# EAGLE design BusPirate-v3.9-SSOP (EAGLE 7.6.0)
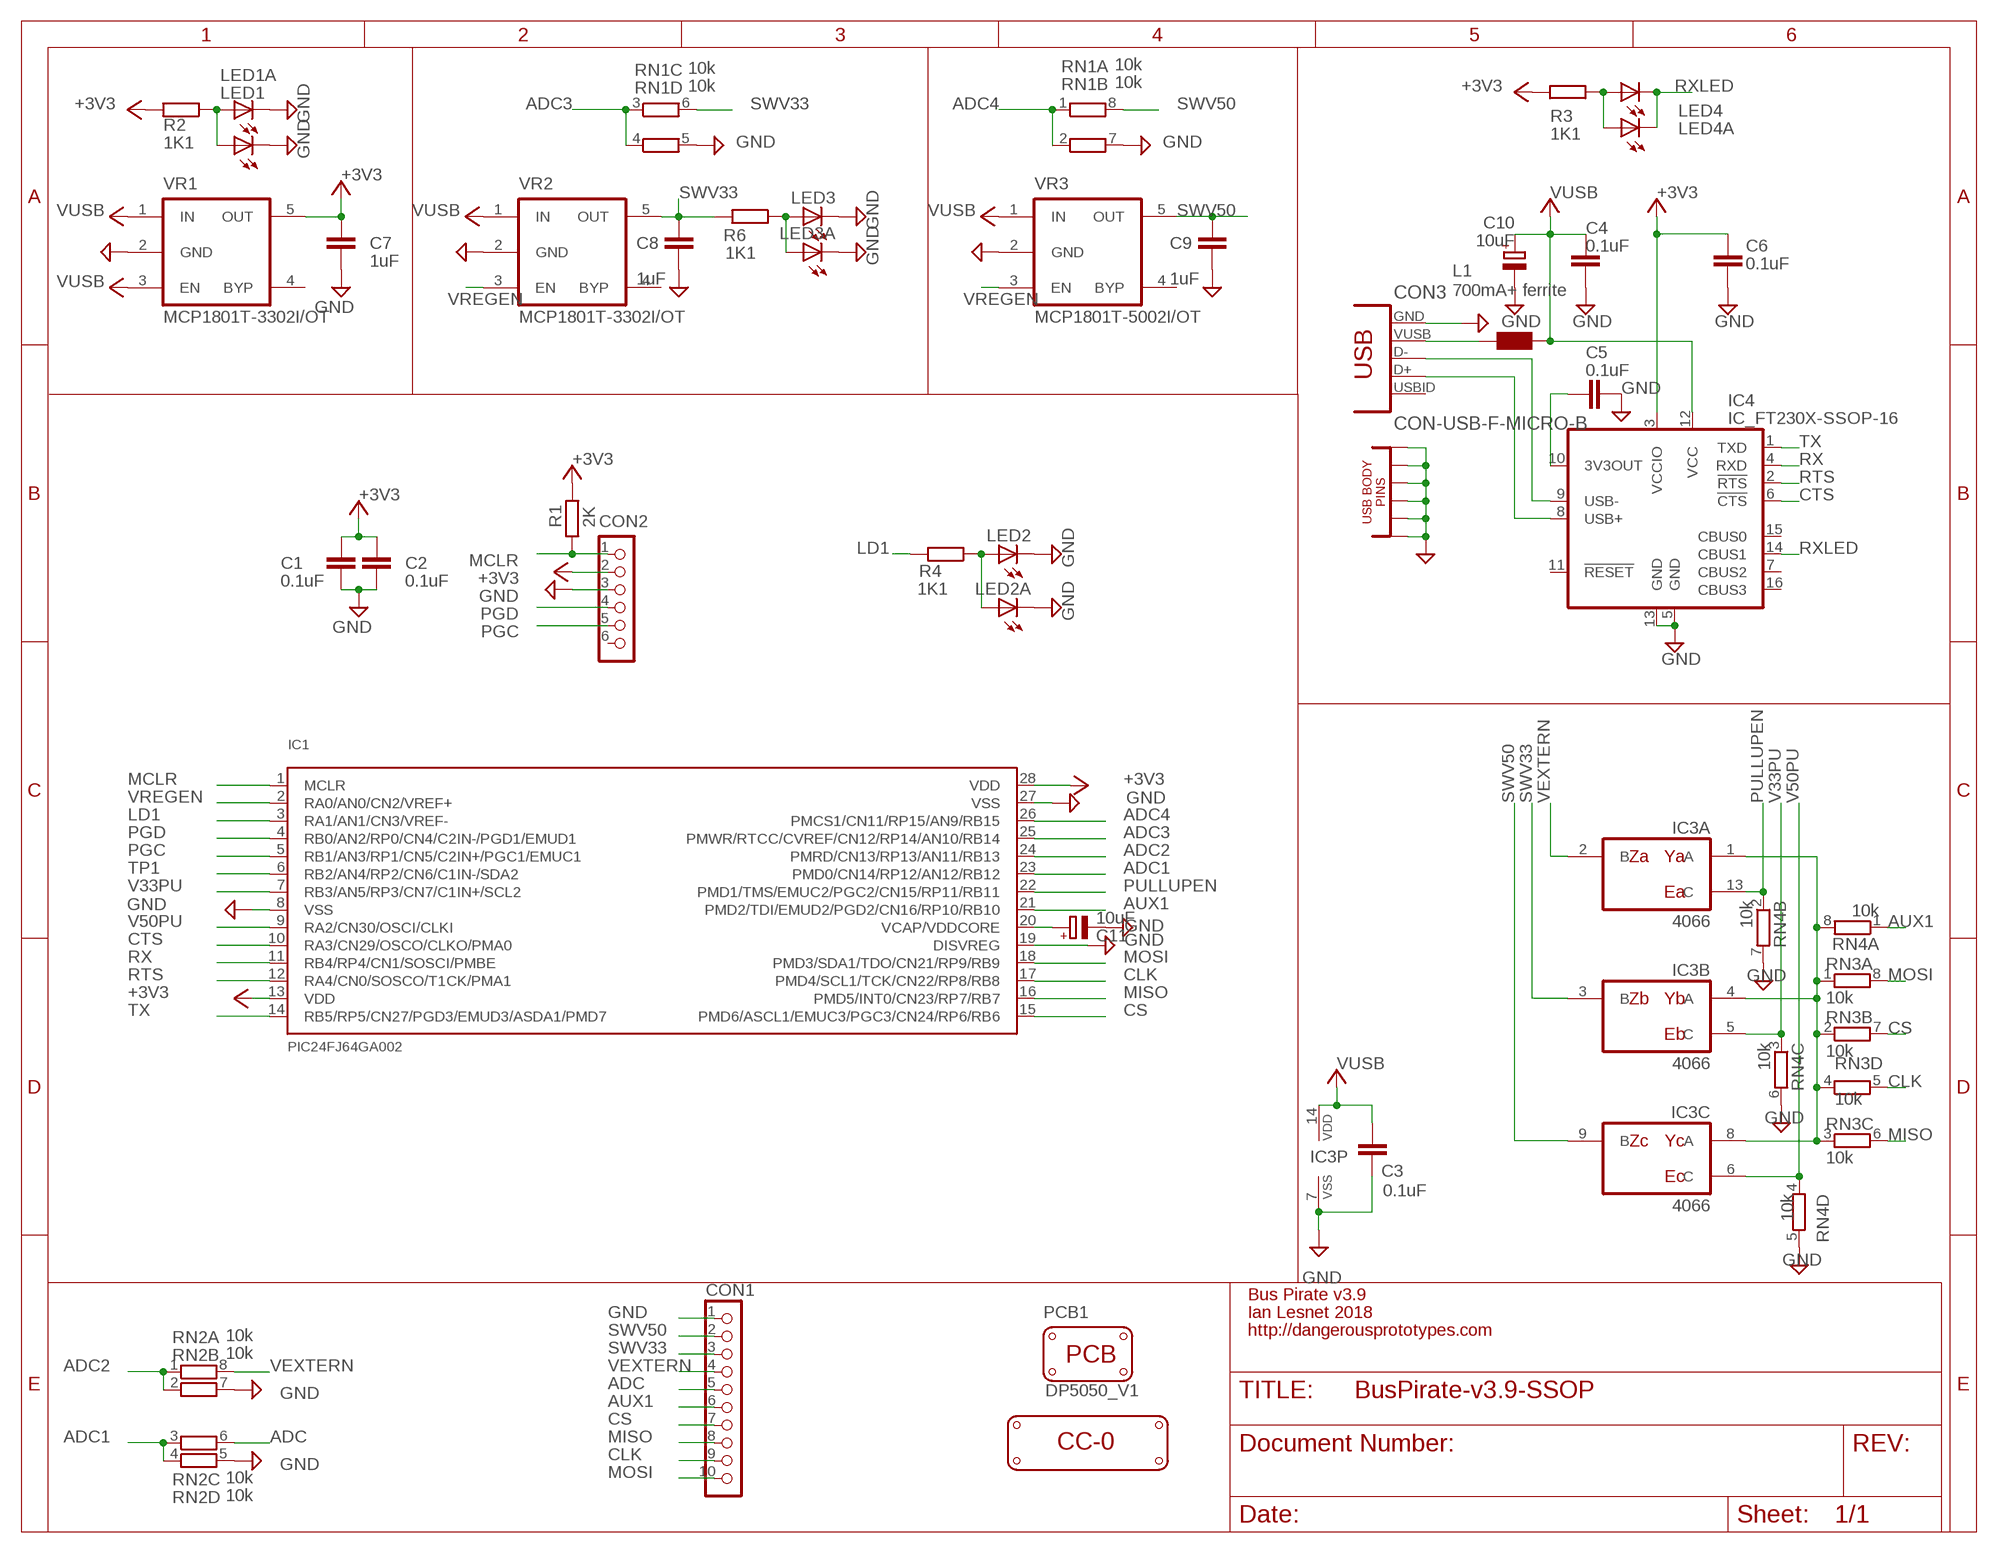
[diagram p0: schematic, sheet 1]

## Parts
C1  0.1uF  CAPC603  [C603]
C2  0.1uF  CAPC603  [C603]
C3  0.1uF  CAPC603  [C603]
C4  0.1uF  CAPC603  [C603]
C5  0.1uF  CAPC603  [C603]
C6  0.1uF  CAPC603  [C603]
C7  1uF  CAPC603  [C603]
C8  1uF  CAPC603  [C603]
C9  1uF  CAPC603  [C603]
C10  10uF  CPOL-EUSMCA  [SMC_A]
C11  10uF  CPOL-EUSMCA  [SMC_A]
CON1  CON_HEADER_1X10-RIGHT_ANGLED_PTH_SHROUDED  [M1X10_MALE_RIGHT_ANGLES_PTH_SHROUDED]
CON2  CON_HEADER_1X06-PTH  [M1X6]
CON3  CON-USB-F-MICRO-B  [CON_USB_MICRO-B-1-MD05SMXXX-01]
IC1  PIC24FJ64GA002  [SSOP28]
IC3  4066  [TSSOP14]
IC4  IC_FT230X-SSOP-16  [SSOP-16-FTDI]
L1  700mA+ ferrite  WE-KIL_0805  [WE-KI_0805_B]
LED1  LED-0805  [LED-805]
LED1A  LED-0805  [LED-805]
LED2  LED-0805  [LED-805]
LED2A  LED-0805  [LED-805]
LED3  LED-0805  [LED-805]
LED3A  LED-0805  [LED-805]
LED4  LED-0805  [LED-805]
LED4A  LED-0805  [LED-805]
LOGO1  LOGO_CC-0  [LOGO_CC-0]
PCB1  PCB_DP_SQUARE-5X5  [DP5050_V1]
R1  2K  RESISTORR603  [R603]
R2  1K1  RESISTORR603  [R603]
R3  1K1  RESISTORR603  [R603]
R4  1K1  RESISTORR603  [R603]
R6  1K1  RESISTORR603  [R603]
RN1  10k  RNETWORK  [RN8P-4R-CRA06S]
RN2  10k  RNETWORK  [RN8P-4R-CRA06S]
RN3  10k  RNETWORK  [RN8P-4R-CRA06S]
RN4  10k  RNETWORK  [RN8P-4R-CRA06S]
VR1  MCP1801T-3302I/OT  MIC5205  [SOT-23-5]
VR2  MCP1801T-3302I/OT  MIC5205  [SOT-23-5]
VR3  MCP1801T-5002I/OT  MIC5205  [SOT-23-5]

## Nets
$N26: CON3.P1(VUSB) L1.2
+3V3: C1.1 C2.1 C6.1 C7.1 CON2.2 IC1.13(VDD) IC1.28(VDD) IC4.3(VCCIO) R1.2 R2.2 R3.2 VR1.5(OUT) ; supply symbol labelled SUPPLY_+3V3
ADC: CON1.5 RN2.6
ADC1: IC1.23(PMD0/CN14/RP12/AN12/RB12) RN2.3 RN2.4
ADC2: IC1.24(PMRD/CN13/RP13/AN11/RB13) RN2.1 RN2.2
ADC3: IC1.25(PMWR/RTCC/CVREF/CN12/RP14/AN10/RB14) RN1.3 RN1.4
ADC4: IC1.26(PMCS1/CN11/RP15/AN9/RB15) RN1.1 RN1.2
AUX1: CON1.6 IC1.21(PMD2/TDI/EMUD2/PGD2/CN16/RP10/RB10) RN4.1
CLK: CON1.9 IC1.17(PMD4/SCL1/TCK/CN22/RP8/RB8) RN3.5
CS: CON1.7 IC1.15(PMD6/ASCL1/EMUC3/PGC3/CN24/RP6/RB6) RN3.7
CTS: IC1.10(RA3/CN29/OSCO/CLKO/PMA0) IC4.6(!CTS)
GND: C1.2 C2.2 C3.2 C4.2 C5.2 C6.2 C7.2 C8.2 C9.2 C10.- C11.- CON1.1 CON2.3 CON3.GND1 CON3.GND2 CON3.GND3 CON3.GND4 CON3.GND5 CON3.GND6 CON3.P5(GND) IC1.8(VSS) IC1.19(DISVREG) IC1.27(VSS) IC3.7(P:VSS) IC4.5(GND) IC4.13(GND) LED1.C LED1A.C LED2.C LED2A.C LED3.C LED3A.C RN1.5 RN1.7 RN2.5 RN2.7 RN4.5 RN4.6 RN4.7 VR1.2(GND) VR2.2(GND) VR3.2(GND)
LD1: IC1.3(RA1/AN1/CN3/VREF-) R4.2
MCLR: CON2.1 IC1.1(MCLR) R1.1
MISO: CON1.8 IC1.16(PMD5/INT0/CN23/RP7/RB7) RN3.6
MOSI: CON1.10 IC1.18(PMD3/SDA1/TDO/CN21/RP9/RB9) RN3.8
N$3: C11.+ IC1.20(VCAP/VDDCORE)
N$6: LED2.A LED2A.A R4.1
N$7: LED1.A LED1A.A R2.1
N$8: C5.1 IC4.10(3V3OUT)
N$10: IC3.1(A:A) IC3.4(B:A) IC3.8(C:A) RN3.1 RN3.2 RN3.3 RN3.4 RN4.8
N$13: LED4.A LED4A.A R3.1
N$15: CON3.P3(D+) IC4.8(USB+)
N$16: CON3.P2(D-) IC4.9(USB-)
N$18: LED3.A LED3A.A R6.1
PGC: CON2.5 IC1.5(RB1/AN3/RP1/CN5/C2IN+/PGC1/EMUC1)
PGD: CON2.4 IC1.4(RB0/AN2/RP0/CN4/C2IN-/PGD1/EMUD1)
PULLUPEN: IC1.22(PMD1/TMS/EMUC2/PGC2/CN15/RP11/RB11) IC3.13(A:C) RN4.2
RTS: IC1.12(RA4/CN0/SOSCO/T1CK/PMA1) IC4.2(!RTS)
RX: IC1.11(RB4/RP4/CN1/SOSCI/PMBE) IC4.4(RXD)
RXLED: IC4.14(CBUS1) LED4.C LED4A.C
SWV33: C8.1 CON1.3 IC3.3(B:B) R6.2 RN1.6 VR2.5(OUT)
SWV50: C9.1 CON1.2 IC3.9(C:B) RN1.8 VR3.5(OUT)
TP1: IC1.6(RB2/AN4/RP2/CN6/C1IN-/SDA2)
TX: IC1.14(RB5/RP5/CN27/PGD3/EMUD3/ASDA1/PMD7) IC4.1(TXD)
V33PU: IC1.7(RB3/AN5/RP3/CN7/C1IN+/SCL2) IC3.5(B:C) RN4.3
V50PU: IC1.9(RA2/CN30/OSCI/CLKI) IC3.6(C:C) RN4.4
VEXTERN: CON1.4 IC3.2(A:B) RN2.8
VREGEN: IC1.2(RA0/AN0/CN2/VREF+) VR2.3(EN) VR3.3(EN)
VUSB: C3.1 C4.1 C10.+ IC3.14(P:VDD) IC4.12(VCC) L1.1 VR1.1(IN) VR1.3(EN) VR2.1(IN) VR3.1(IN) ; supply symbol labelled SUPPLY_VUSB
Unconnected: CON2.6 CON3.P4(USBID) IC3.10(D:B) IC3.11(D:A) IC3.12(D:C) IC4.7(CBUS2) IC4.11(!RESET) IC4.15(CBUS0) IC4.16(CBUS3) VR1.4(BYP) VR2.4(BYP) VR3.4(BYP)

## Notes on the sheet
- Za | Ya
- Ea
- Zb | Yb
- Eb
- Zc | Yc
- Ec
- Bus Pirate v3.9
- Ian Lesnet 2018
- http://dangerousprototypes.com

## Library data of the parts
C1-C9 = dp_devices:CAP
C10 C11 = rcl:CPOL-EU: POLARIZED CAPACITOR, European symbol
CON1 = dp_devices.v6:CON_HEADER_1X10
CON2 = dp_devices.v6:CON_HEADER_1X06
CON3 = dp_devices.v6:CON-USB-F-MICRO-B: Micro USB 5P/F B Type SMT 1-MD05SMXXX-01
IC1 = dp_devices:PIC24FJ64GA002: 16-bit General Purpose Flash Microcontroller
IC3 = 40xx:4066: Quad bilateral ANALOG SWITCH
IC4 = dp_devices.v6:IC_FT230X: BASIC USB to UART IC
L1 = wuerth-elektronik:WE-KIL: SMD Wire Wound Ceramic Inductor WE-KIL - Low profile - High Q values -- Bluetooth -- Wireless LAN -- RF oscillation circuit -- IF impedance matching
LED1 LED1A LED2 LED2A LED3 LED3A LED4 LED4A = dp_devices.v6:LED: Light Emitting Diode
LOGO1 = dp_devices:LOGO_CC-0
PCB1 = dp_devices.v6:PCB_DP_SQUARE: Dangerous Prototypes Standard Square PCB sizes; PCB_SIZE: DP5050_V1
R1-R4 R6 = dp_devices:RESISTOR
RN1-RN4 = dp_devices:RNETWORK: 4 Resistor Array 0603
VR1-VR3 = dp_devices:MIC5205: 150ma Low-Noise LDO Regulator

## Board
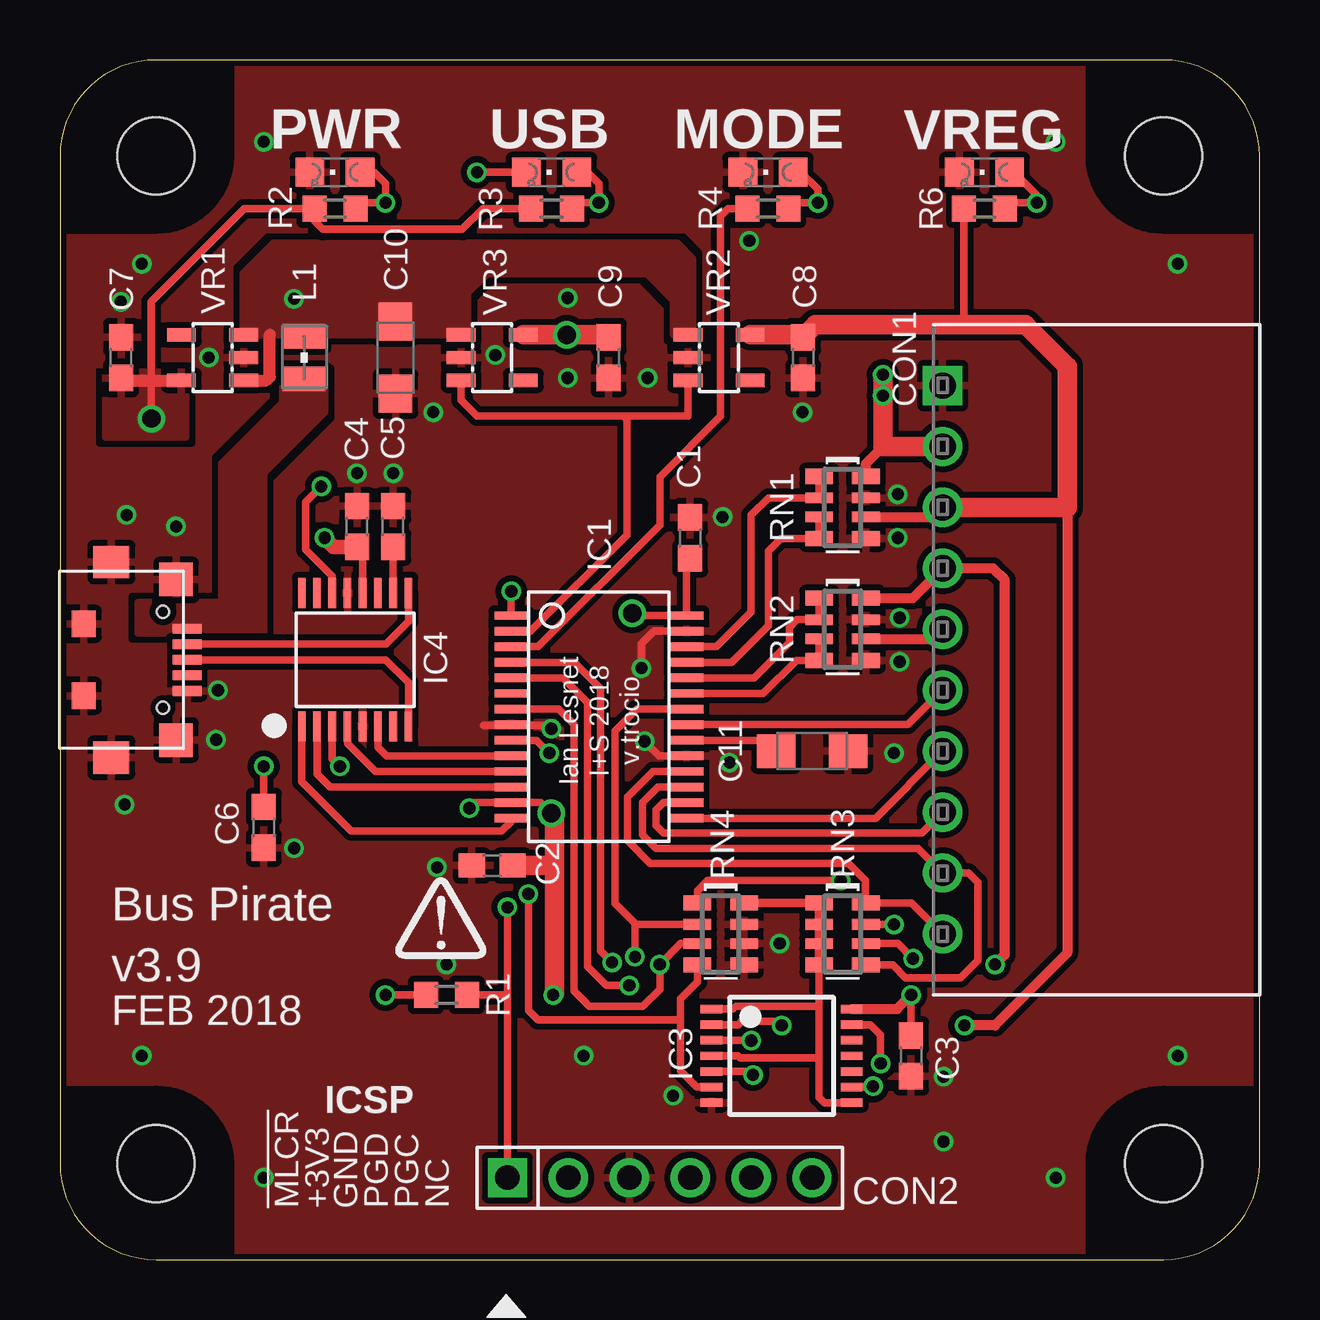
[diagram p1: board, top side]
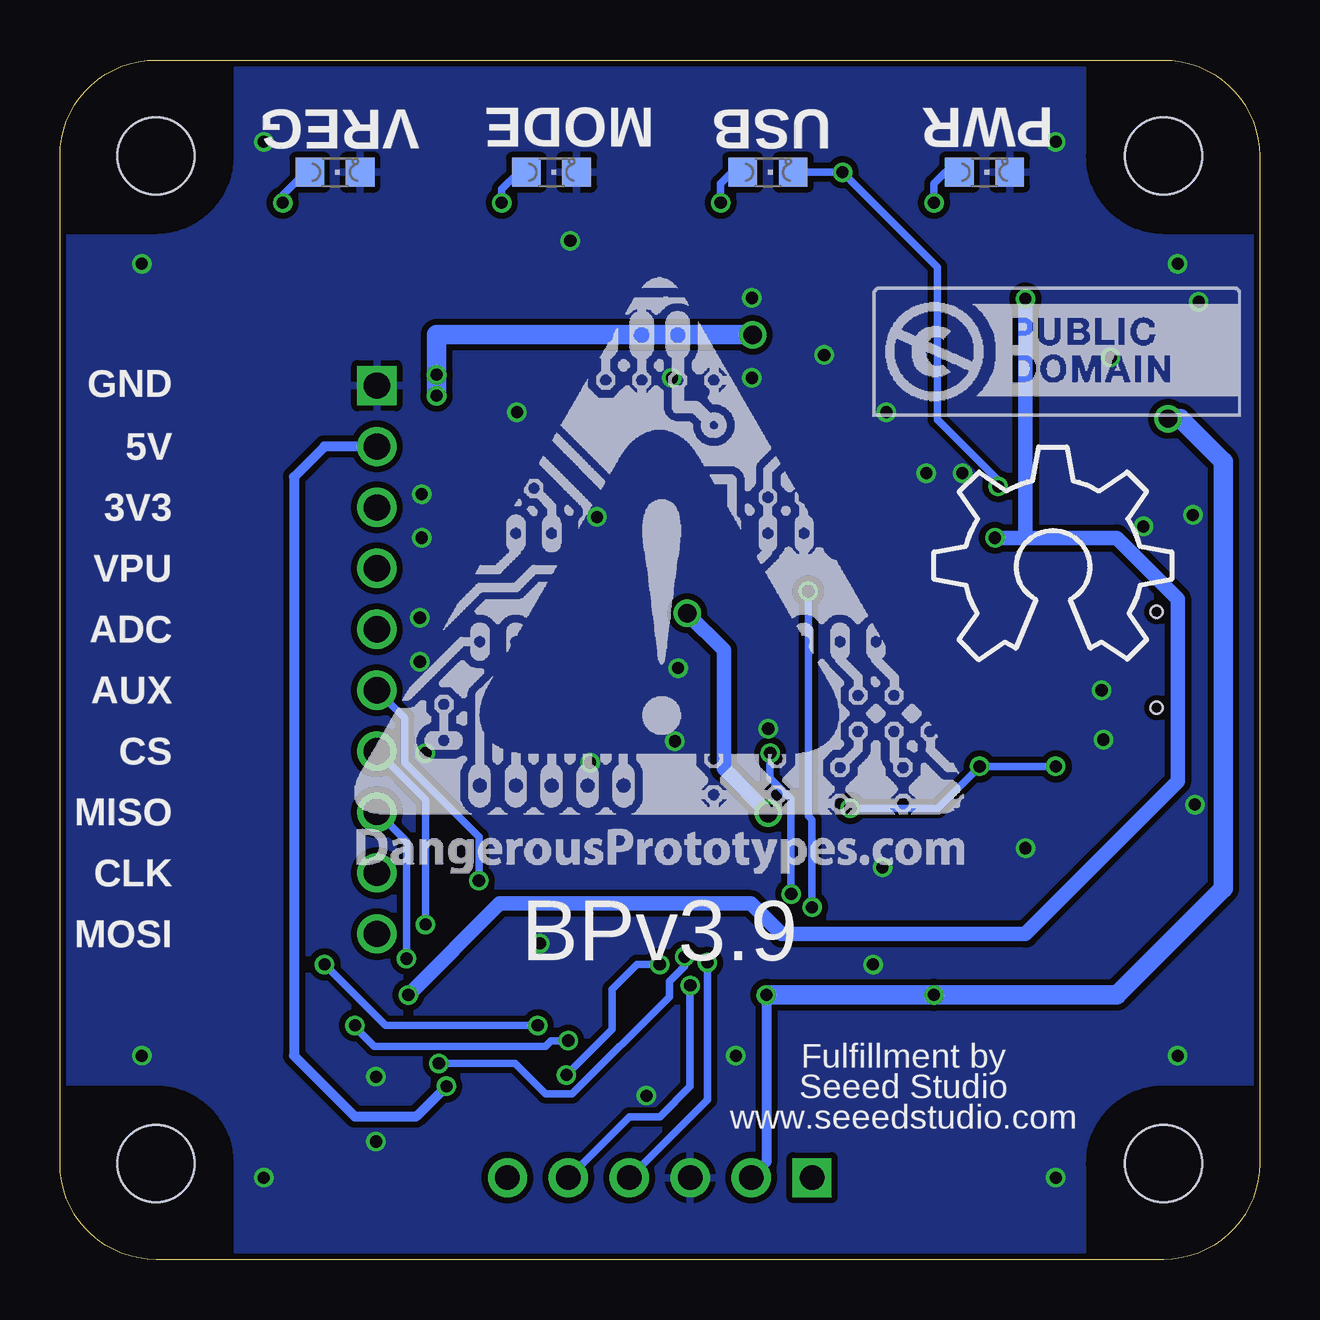
[diagram p2: board, bottom side, seen from below]

Size 50 x 50 mm. Coordinates in mm from the lower left corner, seen from the top.
Copper layers (1*16): Top 0.035mm / dielectric 1.5mm / Bottom 0.035mm
Design rules "dirt_cheap_dirty_boards.v1.1": minimum track width 6mil, minimum drill 12mil, track to track 6mil, track to pad 6mil, pad to pad 6mil, via to via 6mil, smd to smd 0mil, copper to edge 10mil, drill to drill 10mil, minimum pad ring 10mil, minimum via ring 6mil, stop-mask expansion 2mil, vias tented up to drill 25mil, thermal gap 10mil

### Footprints (pad centres in the part's own frame; a part is rotated, then mirrored left to right if it is on the bottom)
C603 = smd 1.1 x 1: 1 -0.85,0; 2 0.85,0
SMC_A = smd 1.6 x 1.4: + -1.5,0; - 1.5,0
M1X10_MALE_RIGHT_ANGLES_PTH_SHROUDED = drill 1.09 square: 1 -11.43,-6.415 | drill 1.09: 2 -8.89,-6.415; 3 -6.35,-6.415; 4 -3.81,-6.415; 5 -1.27,-6.415; 6 1.27,-6.415; 7 3.81,-6.415; 8 6.35,-6.415; 9 8.89,-6.415; 10 11.43,-6.415
M1X6 = drill 1.02 pad 1.632 square: 1 0,0 | drill 1.02 pad 1.632: 2 2.54,0; 3 5.08,0; 4 7.62,0; 5 10.16,0; 6 12.7,0
CON_USB_MICRO-B-1-MD05SMXXX-01 = smd 1.35 x 1.5: GND1 -4.075,0; GND2 4.075,0 | smd 1.4 x 1.4: GND3 -3.35,2.7; GND4 3.35,2.7 | smd 1.1 x 1: GND5 -1.5,-1.15; GND6 1.5,-1.15 | smd 0.4 x 1.2: P1 -1.3,3.16; P2 -0.65,3.16; P3 0,3.16; P4 0.65,3.16; P5 1.3,3.16 | hole 0.5: -2,2.15; 2,2.15
SSOP28 = smd 0.348 x 1.397: 1 -4.225,-3.656; 2 -3.575,-3.656; 3 -2.925,-3.656; 4 -2.275,-3.656; 5 -1.625,-3.656; 6 -0.975,-3.656; 7 -0.325,-3.656; 8 0.325,-3.656; 9 0.975,-3.656; 10 1.625,-3.656; 11 2.275,-3.656; 12 2.925,-3.656; 13 3.575,-3.656; 14 4.225,-3.656; 15 4.225,3.656; 16 3.575,3.656; 17 2.925,3.656; 18 2.275,3.656; 19 1.625,3.656; 20 0.975,3.656; 21 0.325,3.656; 22 -0.325,3.656; 23 -0.975,3.656; 24 -1.625,3.656; 25 -2.275,3.656; 26 -2.925,3.656; 27 -3.575,3.656; 28 -4.225,3.656
TSSOP14 = smd 0.35 x 0.9: 1 -1.95,-2.925; 2 -1.3,-2.925; 3 -0.65,-2.925; 4 0,-2.925; 5 0.65,-2.925; 6 1.3,-2.925; 7 1.95,-2.925; 8 1.95,2.925; 9 1.3,2.925; 10 0.65,2.925; 11 0,2.925; 12 -0.65,2.925; 13 -1.3,2.925; 14 -1.95,2.925
SSOP-16-FTDI = smd 0.32 x 1.26: 1 -2.223,-2.779; 2 -1.588,-2.779; 3 -0.953,-2.779; 4 -0.318,-2.779; 5 0.317,-2.779; 6 0.952,-2.779; 7 1.587,-2.779; 8 2.222,-2.779; 9 2.222,2.779; 10 1.587,2.779; 11 0.952,2.779; 12 0.317,2.779; 13 -0.318,2.779; 14 -0.953,2.779; 15 -1.588,2.779; 16 -2.223,2.779
WE-KI_0805_B = smd 1.02 x 1.78: 1 -0.89,0; 2 0.89,0
LED-805 = smd 1.2 x 1.2: A 0,-1.05; C 0,1.05
DP5050_V1 = hole 3.2: -21,-21; 21,-21; 21,21; -21,21
R603 = smd 1 x 1.1: 1 -0.85,0; 2 0.85,0
RN8P-4R-CRA06S = smd 0.63 x 1.15: 1 -1.295,-0.975; 4 1.295,-0.975; 5 1.295,0.975; 8 -1.295,0.975 | smd 0.44 x 1.15: 2 -0.4,-0.975; 3 0.4,-0.975; 6 0.4,0.975; 7 -0.4,0.975
SOT-23-5 = smd 0.55 x 1.2: 1 -0.95,-1.3; 2 0,-1.3; 3 0.95,-1.3; 4 0.95,1.3; 5 -0.95,1.3

### Placement (x,y rotation side)
C1  26.27,30.08 90 top
C2  18.02,16.42 180 top
C3  35.48,8.49 270 top
C4  12.38,30.56 90 top
C5  13.89,30.56 90 top
C6  8.49,18.02 270 top
C7  2.55,37.59 90 top
C8  30.97,37.59 270 top
C9  22.87,37.59 270 top
C10  13.98,37.59 270 top
C11  31.35,21.19 0 top
CON1  43.2,25 270 top
CON2  18.65,3.41 0 top
CON3  2.14,25 270 top
IC1  22.46,22.62 270 top
IC3  30.08,8.49 270 top
IC4  12.3,25 0 top
L1  10.17,37.59 270 top
LED1  11.46,45.32 90 top
LED1A  11.46,45.32 270 bottom
LED2  29.51,45.32 90 top
LED2A  29.51,45.32 270 bottom
LED3  38.54,45.32 90 top
LED3A  38.54,45.32 270 bottom
LED4  20.49,45.32 90 top
LED4A  20.49,45.32 270 bottom
LOGO1  16.11,35.16 0 bottom
PCB1  25,25 0 top
R1  16.11,11.03 180 top
R2  11.46,43.8 180 top
R3  20.49,43.8 180 top
R4  29.51,43.8 180 top
R6  38.54,43.8 180 top
RN1  32.62,31.35 270 top
RN2  32.62,26.27 270 top
RN3  32.62,13.57 270 top
RN4  27.54,13.57 270 top
U$1  [DP-LOGO]  13.97,12.54 0 top
U$2  [OSHW_8X350_NOTEXT]  13.57,25 0 bottom
U$3  [DP_LOGO_ART_1X1]  37.7,16.11 0 bottom
VR1  6.36,37.59 90 top
VR2  27.47,37.59 270 top
VR3  18.02,37.59 270 top

### Tracks (layer width: path | path; a pad name or v marks a point on that pad's centre or on a via)
$N26
  pour Top (isolate 0.305, no thermals): 3.25,27.38 6.74,27.38 6.74,33.18 9.28,35.72 9.28,36.91 11.03,36.91 11.03,35.32 8.49,32.78 8.49,26.11 3.25,26.11
+3V3  (via drill 0.51, 0.76)
  Top 0.305: v17.06,18.81 17.3,19.04 IC1.13 20.03,19.04 v20.48,18.6 | C1.1 26.12,29.23 IC1.28 23.95,26.84 v23.86,26.94 | 3.81,36.64 3.81,39.92 7.68,43.8 R2.2 10.61,43.28 10.95,42.94 16.77,42.94 17.63,43.8 R3.2 | 3.81,36.64 VR1.5 | v8.49,20.55 C6.1 | IC4.3 11.35,20.87 v11.67,20.55 | v13.57,11.03 R1.2 | v3.81,35.05 3.81,36.64
  Top 0.406: 20.62,16.29 20.49,16.42
  Top 0.508: VR1.5 2.65,36.64 C7.1
  Top 0.61: 20.62,18.54 v20.48,18.6
  Top 0.813: 20.62,18.54 20.62,16.29 20.62,11.1 v20.55,11.03 | C2.1 20.49,16.42
  Bottom 0.305: v17.06,18.81 13.41,18.81 v11.67,20.55 v8.49,20.55
  Bottom 0.406: v20.55,11.03 20.55,4.05 CON2.2
  Bottom 0.61: v23.86,26.94 22.33,25.41 22.33,20.46 v20.48,18.6
  Bottom 0.813: v20.55,11.03 v13.57,11.03 5.95,11.03 1.51,15.48 1.51,33.26 3.3,35.05 v3.81,35.05
  pour Top: 1.9,36.99 5.24,36.99 5.24,34.29 1.9,34.29
ADC
  Top 0.406: RN2.6 36.39,25.87 CON1.5
ADC1
  Top 0.305: RN2.3 RN2.4 30.69,24.98 29.31,23.59 IC1.23
ADC2
  Top 0.305: RN2.1 RN2.2 30.72,26.67 30.4,26.35 30.4,25.71 28.93,24.24 IC1.24
ADC3
  Top 0.305: RN1.3 RN1.4 30.05,30.05 29.52,29.52 29.52,26.43 27.99,24.89 IC1.25
ADC4
  Top 0.305: RN1.1 RN1.2 29.52,31.75 28.81,31.04 28.81,26.98 27.37,25.54 IC1.26
AUX1  (via drill 0.51)
  Top 0.305: IC1.21 35.35,22.29 CON1.6 | RN4.1 26.57,15.37 26.98,15.79 v32.54,15.79
  Bottom 0.305: v32.54,15.79 32.54,17.62 35.64,20.71 35.64,22.58 CON1.6
CLK
  Top 0.305: IC1.17 24.93,19.69 24.29,19.05 24.29,17.7 24.84,17.14 35.76,17.14 CON1.9 37.86,16.11 38.26,15.71 38.26,12.46 37.54,11.74 35.24,11.74 34.71,12.28 RN3.5
CS  (via drill 0.51)
  Top 0.305: IC1.15 33.99,18.39 CON1.7 | v34.76,13.97 RN3.7
  Bottom 0.305: v34.76,13.97 34.76,19.16 CON1.7
CTS
  Top 0.305: IC1.10 13.61,20.99 13.25,21.35 IC4.6
GND  (via drill 0.51)
  Top 0.305: v24.24,24.65 24.24,25.67 24.77,26.19 IC1.27 25.99,26.2 | IC1.19 24.97,20.99 v24.37,21.6 | 17.66,22.26 20.45,22.26
  other vias: 18.14,37.7 6.2,37.59 30.95,35.32 28.73,42.46 2.54,39.92 34.76,21.11 35,24.92 20.48,22.13 34.92,30.08 21.16,36.75 24.49,36.75 21.16,40.08 15.71,16.35 27.91,20.71 36.83,7.62 16.11,12.3 15.55,35.32 12.38,32.78 13.89,32.78 27.62,30.95 2.78,31.03 4.84,30.56 6.51,21.67 6.59,23.73 9.76,17.14 35,26.75 34.92,31.91 3.41,8.49 8.49,3.41 41.51,3.41 46.59,8.49 46.59,41.51 41.51,46.59 8.49,46.59 3.41,41.51 36.83,4.92 21.83,8.49 25.56,6.82 30,13.17 2.7,18.97
  pour Top (isolate 0.254, rank 6): 0.01,49.98 50.81,49.98 50.81,-0.82 0.01,-0.82
  pour Bottom (isolate 0.254): 0.01,49.98 50.81,49.98 50.81,-0.82 0.01,-0.82
LD1
  Top 0.305: IC1.3 19.92,25.54 25,30.62 25,32.62 27.54,35.16 27.54,43.49 27.85,43.8 R4.2
MCLR  (via drill 0.51)
  Top 0.305: v18.81,27.86 IC1.1 | R1.1 18.65,11.03 | v18.65,14.68 18.65,11.03 | 18.65,11.03 CON2.1
  Bottom 0.305: v18.81,27.86 18.81,18.49 18.65,18.33 v18.65,14.68
MISO  (via drill 0.51)
  Top 0.305: IC1.16 25.16,19.04 24.84,18.73 24.84,18.09 25.16,17.78 35.92,17.78 CON1.8 | RN3.6 34.93,13.17 v35.56,12.54
  Bottom 0.305: v35.56,12.54 35.56,17.42 CON1.8
MOSI
  Top 0.305: IC1.18 24.71,20.34 23.65,19.29 23.65,17.46 24.6,16.51 32.86,16.51 33.57,15.79 33.57,14.89 RN3.8 35.5,14.87 CON1.10
N$3
  Top 0.305: IC1.20 29.55,21.64 C11.+
N$6  (via drill 0.51)
  Top 0.305: LED2A.A 30.87,45.32 31.59,44.61 v31.59,44.05 30.61,44.05 R4.1
  Bottom 0.305: LED2A.A 30.87,45.32 31.59,44.61 v31.59,44.05
N$7  (via drill 0.51)
  Top 0.305: LED1A.A 13.09,45.32 13.57,44.84 v13.57,44.05 12.56,44.05 R2.1
  Bottom 0.305: LED1A.A 13.09,45.32 13.57,44.84 v13.57,44.05
N$8
  Top 0.305: IC4.10 C5.1 | C5.1
N$10
  Top 0.305: IC3.8 31.87,6.54 31.65,6.77 31.65,8.41 | RN3.4 31.65,10.55 | 31.65,10.55 31.65,8.41 | IC3.1 28.06,10.44 28.18,10.55 31.65,10.55 | IC3.4 28.25,8.49 28.33,8.41 31.65,8.41
  Top 0.356: RN4.8 RN3.1 RN3.2 RN3.3 RN3.4
N$13  (via drill 0.51)
  Top 0.305: LED4A.A 21.98,45.32 22.46,44.84 v22.46,44.05 21.59,44.05 R3.1
  Bottom 0.305: LED4A.A 21.98,45.32 22.46,44.84 v22.46,44.05
N$15
  Top 0.305: IC4.8 14.52,24.05 13.57,25 CON3.P3
N$16
  Top 0.305: IC4.9 14.52,26.59 13.59,25.65 CON3.P2
N$18  (via drill 0.51)
  Top 0.305: LED3A.A 39.76,45.32 40.72,44.37 v40.72,44.05 39.64,44.05 R6.1
  Bottom 0.305: LED3A.A 39.76,45.32 40.72,44.37 v40.72,44.05
PGC  (via drill 0.51)
  Top 0.305: IC1.5 20.96,24.24 21.98,23.22 21.98,12.22 22.78,11.43 v23.73,11.43
  Bottom 0.305: CON2.5 26.27,5.95 25,5.95 23.73,7.22 v23.73,11.43
PGD  (via drill 0.51)
  Top 0.305: IC1.4 21.46,24.89 22.54,23.81 22.54,12.86 v23.02,12.38
  Bottom 0.305: v23.02,12.38 23.02,6.66 CON2.4
PULLUPEN  (via drill 0.51)
  Top 0.305: IC1.22 24.05,22.94 23.14,22.03 23.14,14.84 24.01,13.97 | RN4.2 24.01,13.97 | IC3.13 33.78,9.79 34.21,9.36 v34.21,8.17 | v23.97,12.62 23.97,13.93 24.01,13.97
  Bottom 0.305: v34.21,8.17 31.03,8.17 29.76,6.9 28.65,6.9 24.6,10.95 24.6,11.59 23.97,12.22 v23.97,12.62
RTS
  Top 0.305: IC1.12 11.26,19.69 10.71,20.24 IC4.2
RX
  Top 0.305: IC1.11 13.15,20.34 11.98,21.51 IC4.4
RXLED  (via drill 0.51)
  Top 0.305: LED4A.C v17.38,45.32 | IC4.14 11.35,28.49 10.24,29.6 10.24,31.57 v10.89,32.22
  Bottom 0.305: LED4A.C v17.38,45.32 13.43,41.37 13.43,35.02 10.89,32.48 v10.89,32.22
SWV33  (via drill 0.51)
  Top 0.305: R6.2 37.69,38.98 37.7,38.97 | IC3.3 28.8,9.14 v28.81,9.13
  Top 0.406: RN1.6 36.39,30.95 CON1.3 | 41.99,31.35 41.99,12.78 38.97,9.76 v37.7,9.76
  Top 0.508: 30.87,38.54 C8.1
  Top 0.813: VR2.5 30.87,38.54 | C8.1 31.5,38.97 37.7,38.97 40.24,38.97 41.99,37.22 41.99,31.35 CON1.3
  Bottom 0.305: v28.81,9.13 29.52,9.13 29.76,8.89 36.91,8.89 37.7,9.68 v37.7,9.76
SWV50  (via drill 0.51, 0.76)
  Top 0.305: IC3.9 33.86,7.19 v33.89,7.22
  Top 0.406: RN1.8 33.59,33.18 34.3,33.89
  Top 0.508: 22.8,38.59 22.83,38.59 22.87,38.55
  Top 0.61: 22.8,38.59 C9.1
  Top 0.813: VR3.5 20.24,38.54 v21.13,38.55 22.87,38.55 | v34.3,36.88 v34.3,36.01 34.3,33.89 CON1.2
  Bottom 0.406: CON1.2 38.97,33.89 40.24,32.62 40.24,8.49 37.7,5.95 35.16,5.95 v33.89,7.22
  Bottom 0.813: v21.13,38.55 34.3,38.55 v34.3,36.01
TX
  Top 0.305: IC4.1 10.08,20.79 10.08,19.92 12.14,17.86 18.41,17.86 18.8,18.25 IC1.14
V33PU  (via drill 0.51)
  Top 0.305: IC1.7 20.79,22.94 21.43,22.3 21.43,11.19 22.06,10.55 24.29,10.55 25,11.27 v25,12.3 25.87,13.17 RN4.3 | IC3.5 28.75,7.84 v28.89,7.7
  Bottom 0.305: v25,12.3 25.95,12.3 26.98,11.27 26.98,9.6 v28.89,7.7
V50PU  (via drill 0.51)
  Top 0.305: IC1.9 19.86,21.64 v20.4,21.11 | IC3.6 26.54,7.19 25.87,7.86 25.87,9.92 | 25.87,9.92 25.87,10.87 26.57,11.56 RN4.4 | 25.87,9.92 25.79,10 19.92,10 19.52,10.4 v19.52,15.24
  Bottom 0.305: v20.4,21.11 20.4,20.08 19.52,19.21 v19.52,15.24
VEXTERN  (via drill 0.51)
  Top 0.305: IC3.2 28.28,9.79 28.41,9.92 29.92,9.92 v30.08,9.76
  Top 0.406: RN2.8 35.55,27.57 CON1.4 38.89,28.81 39.37,28.33 39.37,12.7 v38.97,12.3
  Bottom 0.305: v30.08,9.76 36.43,9.76 v38.97,12.3
VREGEN
  Top 0.305: 16.71,35.83 17.38,35.16 23.49,35.16 | IC1.2 19.62,26.19 23.63,30.2 23.63,35.02 23.49,35.16 | 16.71,35.83 VR3.3 | 16.71,35.83 | VR2.3 26.17,35.16 23.49,35.16
VUSB  (via drill 0.51)
  Top 0.305: IC4.12 12.62,29.47 C4.1 | C3.1 v35.48,11.03
  Top 0.406: IC3.14 34.89,10.44 v35.48,11.03
  Top 0.508: VR1.1 8.59,36.64 8.74,36.8 8.74,38.55 8.74,38.54
  Top 0.61: v11.03,30.08 11.4,29.71 C4.1
  Bottom 0.61: v9.76,40.05 9.76,30.08 v11.03,30.08 5.95,30.08 3.41,27.54 3.41,19.92 9.76,13.57 19.92,13.57 21.19,14.84 31.67,14.84 v35.48,11.03
  pour Top (isolate 0.305, no thermals): 7.63,41.09 7.63,38.55 17,38.55 17,40.29 17.79,41.09 24.46,41.09 25.57,39.98 25.57,38.55 26.36,38.55 26.36,41.72 25.73,42.36 8.9,42.36

### Text on the board
tPlace: ICSP | !MLCR | +3V3 | GND | PGD | PGC | NC
bPlace: GND | 5V | 3V3 | VPU | ADC | AUX | CS | MISO | CLK | MOSI
tNames: PWR | USB | MODE | VREG | Ian Lesnet | I+S 2018 | v.trocio | Bus Pirate | v3.9 | FEB 2018
bNames: PWR | USB | MODE | VREG | BPv3.9 | Fulfillment by | Seeed Studio | www.seeedstudio.com
Reference: I/O header | GND | 5V | 3V3 | VPU | ADC | AUX | CS | MISO | CLK | MOSI | Bus Pirate v3.9 | Ian Lesnet | CC-0 | FEB 2018 | http://dangerousprototypes.com | MCLR | +3.3V | GND | DATA | CLOCK | NC | ICSP Programming Header